# Altium project test.PrjPCB
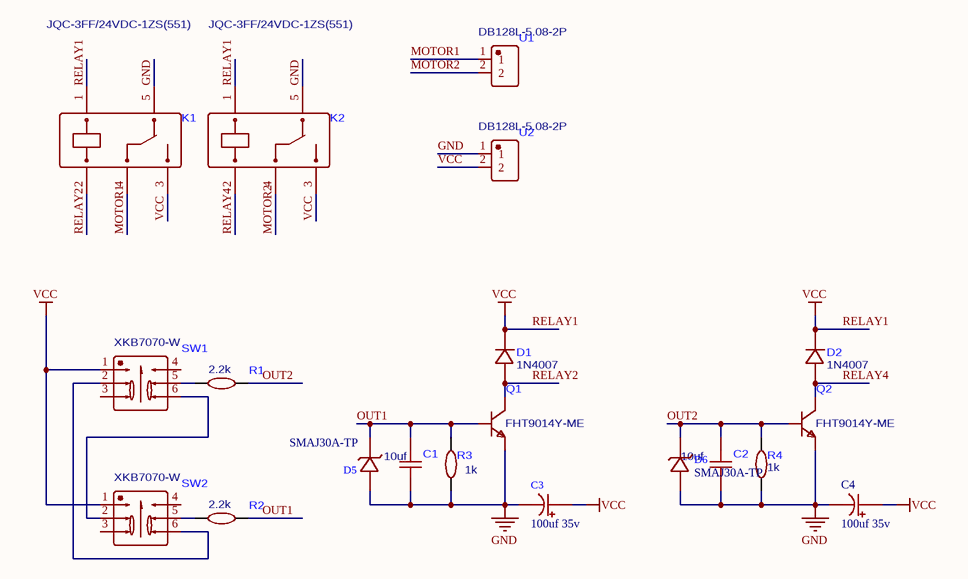
[diagram p0: drive.SchDoc]
1 sheet, 20 parts. Net scope: global (net labels, ports and power ports of the same name join across sheets).
Board file: drive.PcbDoc

## Sheet drive.SchDoc
size A4

### Parts
C1  10uf  [C1210]
C2  10uf  [C1210]
C3  100uf 35v  [100uf 35v]
C4  100uf 35v  [100uf 35v]
D1  1N4007  [SMA_L4.4-W2.6-LS5.0-RD]
D2  1N4007  [SMA_L4.4-W2.6-LS5.0-RD]
D5  SMAJ30A-TP  [SMAJ16A-TP]
D6  SMAJ30A-TP  [SMAJ16A-TP]
K1  JQC-3FF/24VDC-1ZS(551)  [RELAY-TH_HF3FF/XX-1ZXX(XXX)]
K2  JQC-3FF/24VDC-1ZS(551)  [RELAY-TH_HF3FF/XX-1ZXX(XXX)]
Q1  FHT9014Y-ME  [SOT-23-3_L2.9-W1.3-P1.90-LS2.4-BR]
Q2  FHT9014Y-ME  [SOT-23-3_L2.9-W1.3-P1.90-LS2.4-BR]
R1  2.2k  [R0402]
R2  2.2k  [R0402]
R3  1k  [R0402]
R4  1k  [R0402]
SW1  XKB7070-W  [SW-TH_6P-L7.2-W7.2-P2.00-LS5.0]
SW2  XKB7070-W  [SW-TH_6P-L7.2-W7.2-P2.00-LS5.0]
U1  DB128L-5.08-2P  [CONN-TH_2P-P5.08_DB128L-5.08-2P]
U2  DB128L-5.08-2P  [CONN-TH_2P-P5.08_DB128L-5.08-2P]

### Nets
GND: C1.2 C2.2 C3.2 C4.2 D5.2(A) D6.2(A) K1.5 K2.5 Q1.2(E) Q2.2(E) R3.1 R4.1 U2.1
RELAY1: C3.1 C4.1 D1.1(K) D2.1(K) K1.1 K1.3 K2.1 K2.3 SW1.1 SW2.1 U2.2  [also labelled VCC]
MOTOR1: K1.4 U1.1
MOTOR2: K2.4 U1.2
OUT1: C1.1 D5.1(K) Q1.1(B) R2.2 R3.2
OUT2: C2.1 D6.1(K) Q2.1(B) R1.2 R4.2
RELAY2: D1.2(A) K1.2 Q1.3(C)
RELAY4: D2.2(A) K2.2 Q2.3(C)
NetR1_1: R1.1 SW1.5
NetR2_1: R2.1 SW2.5
NetSW1_2: SW1.2 SW2.6
NetSW1_6: SW1.6 SW2.2

Not connected (* = marked no-connect by the designer): SW1 3 4; SW2 3 4

### Library data of the parts
C1 C2 = EMK325ABJ107MM-P
D5 D6 = SMAJ16A-TP
K1 K2 = JQC-3FF/12VDC-1ZS(551)
R1-R4 = MFR0S2F1001A20